# EAGLE board BansheeNornV5 (EAGLE 9.6.2), part 1 of 2
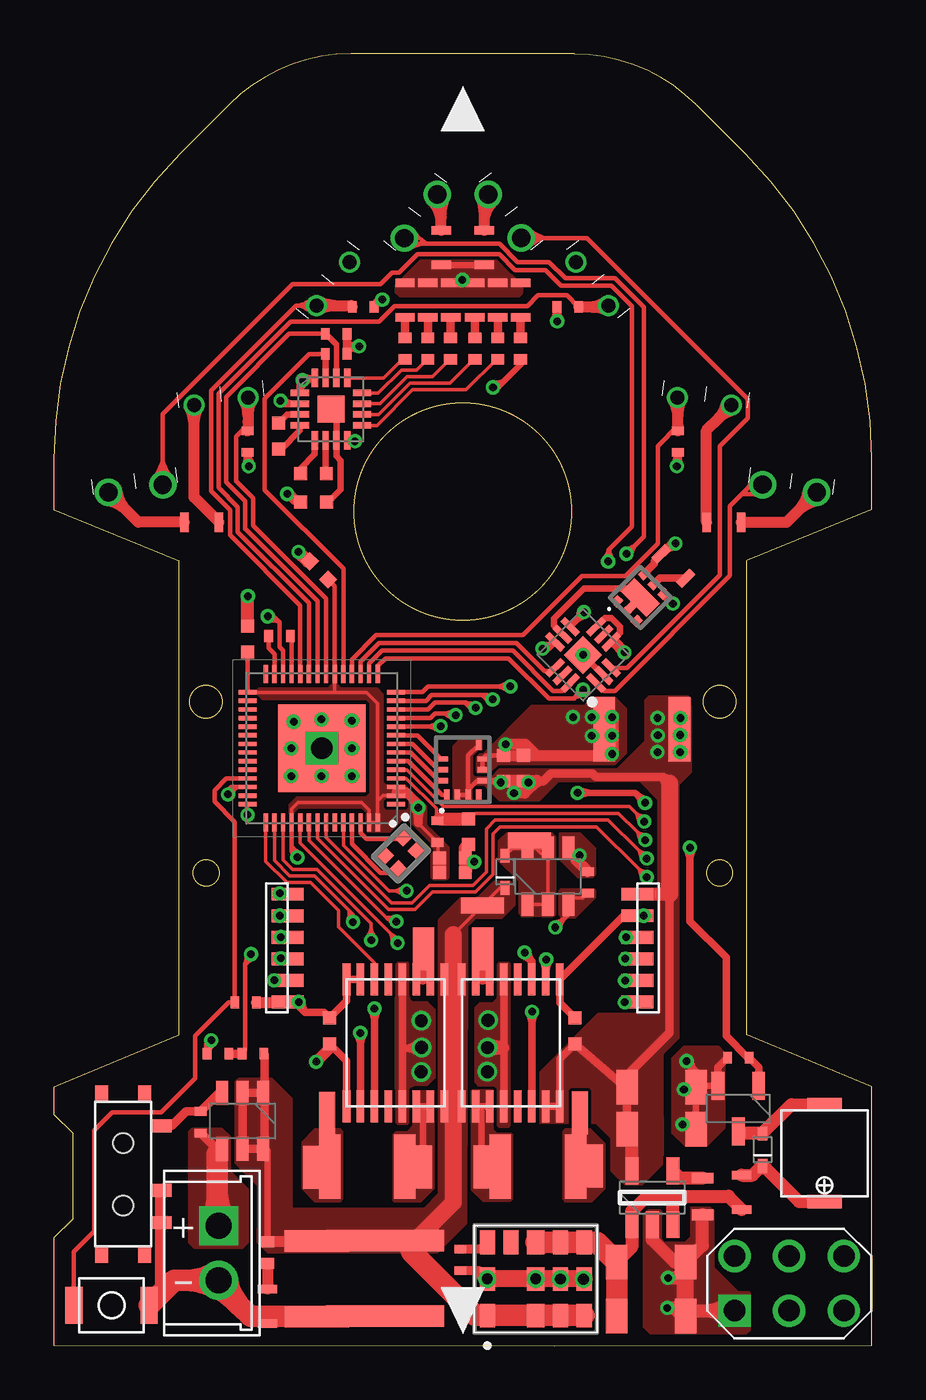
[diagram p2: board, top side]
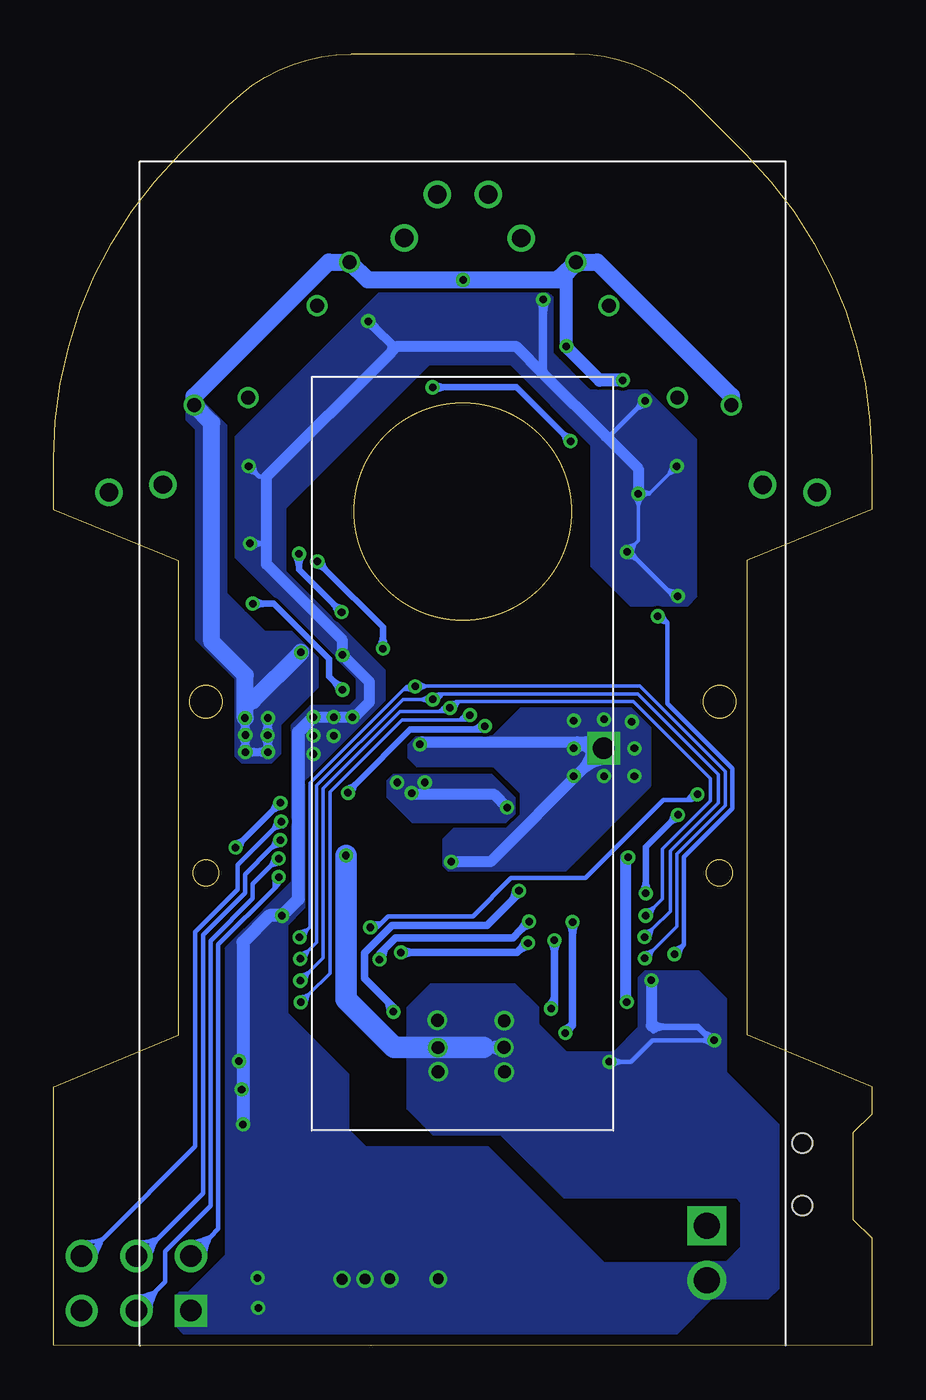
[diagram p3: board, bottom side, seen from below]

Size 38 x 60.01 mm. Coordinates in mm from the lower left corner, seen from the top.
Outline: 32.13,55.36 29.84,57.65 arc45 24.18,59.99
Outline: 32.13,55.36 arc-45 38,41.21 38,38.85 32.21,36.46 32.21,14.44 38,12.03 38,0.01 23.25,0 0,0.01 0,5 0.88,5.88 0.88,9.88 0,10.75 0,12.03 5.79,14.44 5.79,36.46 0,38.85 0,41.21
Outline: 8.15,57.65 5.87,55.36 arc45 0,41.21
Outline: 24.18,60.01 13.82,60.01 arc45 8.15,57.65
Outline: circle at 7.08,21.96 radius 0.6
Outline: circle at 7.08,29.92 radius 0.76
Outline: circle at 30.93,21.96 radius 0.6
Outline: circle at 30.93,29.92 radius 0.76
Outline: circle at 19,38.75 radius 5.05
Copper layers (1*16): Top 0.035mm / dielectric 1.6mm / Bottom 0.035mm
Design rules "Elecrow_2-layer_PCB_eagle_rule *": minimum track width 6mil, minimum drill 12mil, track to track 6mil, track to pad 6mil, pad to pad 6mil, via to via 8mil, smd to smd 0mil, copper to edge 20mil, drill to drill 10mil, minimum pad ring 6mil, minimum via ring 6mil, stop-mask expansion 0mil, vias tented up to drill 100mil, thermal gap 0mil

## Footprints (pad centres in the part's own frame; a part is rotated, then mirrored left to right if it is on the bottom)
C3216 = smd 1 x 1.6: 1 -1.6,0; 2 1.6,0
R1005 = smd 0.6 x 0.6: P$1 -0.6,0; P$2 0.6,0
C1608 = smd 0.5 x 1: 1 -0.85,0; 2 0.85,0
HRCON-2 = drill 1.2 pad 1.778 square: 1 0,0 | drill 1.2 pad 1.778: 2 0,-2.54
SODFL1608X70N = smd 0.64 x 0.42: 1 -0.75,0; 2 0.75,0
QFN40P700X700X90-57N = smd 0.85 x 0.2: 1 -3.45,2.6; 2 -3.45,2.2; 3 -3.45,1.8; 4 -3.45,1.4; 5 -3.45,1; 6 -3.45,0.6; 7 -3.45,0.2; 8 -3.45,-0.2; 9 -3.45,-0.6; 10 -3.45,-1; 11 -3.45,-1.4; 12 -3.45,-1.8; 13 -3.45,-2.2; 14 -3.45,-2.6; 29 3.45,-2.6; 30 3.45,-2.2; 31 3.45,-1.8; 32 3.45,-1.4; 33 3.45,-1; 34 3.45,-0.6; 35 3.45,-0.2; 36 3.45,0.2; 37 3.45,0.6; 38 3.45,1; 39 3.45,1.4; 40 3.45,1.8; 41 3.45,2.2; 42 3.45,2.6 | smd 0.2 x 0.85: 15 -2.6,-3.45; 16 -2.2,-3.45; 17 -1.8,-3.45; 18 -1.4,-3.45; 19 -1,-3.45; 20 -0.6,-3.45; 21 -0.2,-3.45; 22 0.2,-3.45; 23 0.6,-3.45; 24 1,-3.45; 25 1.4,-3.45; 26 1.8,-3.45; 27 2.2,-3.45; 28 2.6,-3.45; 43 2.6,3.45; 44 2.2,3.45; 45 1.8,3.45; 46 1.4,3.45; 47 1,3.45; 48 0.6,3.45; 49 0.2,3.45; 50 -0.2,3.45; 51 -0.6,3.45; 52 -1,3.45; 53 -1.4,3.45; 54 -1.8,3.45; 55 -2.2,3.45; 56 -2.6,3.45 | smd 4.05 x 4.05: 57 0,0
QFN50P300X300X80-17N = smd 0.85 x 0.3: 1 -1.45,0.75; 2 -1.45,0.25; 3 -1.45,-0.25; 4 -1.45,-0.75; 9 1.45,-0.75; 10 1.45,-0.25; 11 1.45,0.25; 12 1.45,0.75 | smd 0.3 x 0.85: 5 -0.75,-1.45; 6 -0.25,-1.45; 7 0.25,-1.45; 8 0.75,-1.45; 13 0.75,1.45; 14 0.25,1.45; 15 -0.25,1.45; 16 -0.75,1.45 | smd 1.25 x 1.25: 17 0,0
LGA-14(2.5X3X0.86) = smd 0.475 x 0.25: 1 -1.163,0.75; 2 -1.163,0.25; 3 -1.163,-0.25; 4 -1.163,-0.75; 8 1.163,-0.75 | smd 0.25 x 0.475: 5 -0.5,-0.912; 6 0,-0.912; 7 0.5,-0.912; 12 0.5,0.912; 13 0,0.912; 14 -0.5,0.912
SOT95P275X110-5N = smd 1.25 x 0.6: 1 -1.25,0.95; 2 -1.25,0; 3 -1.25,-0.95; 4 1.25,-0.95; 5 1.25,0.95
QFN50P300X300X100-13N = smd 1 x 0.3: 1 -1.35,0.5; 2 -1.35,0; 3 -1.35,-0.5; 7 1.35,-0.5; 8 1.35,0; 9 1.35,0.5 | smd 0.3 x 1: 4 -0.5,-1.35; 5 0,-1.35; 6 0.5,-1.35; 10 0.5,1.35; 11 0,1.35; 12 -0.5,1.35 | smd 1.25 x 1.25: 13 0,0
BCR421UFD7 = smd 0.37 x 0.45: 1 -0.65,-0.886; 3 0.65,-0.886; 4 0.65,0.886; 5 0,0.886; 6 -0.65,0.886 | smd 0.37 x 0.6: 2 0,-0.75 | smd 1.67 x 0.9: 7 0,0
LTR4206E = drill 0.65 pad 0.9: 1 -1.27,0; 2 1.27,0
SOT95P284X110-6N = smd 1.1 x 0.55: 1 -1.3,0.95; 2 -1.3,0; 3 -1.3,-0.95; 4 1.3,-0.95; 5 1.3,0; 6 1.3,0.95
SOT95P237X112-3N = smd 1.3 x 0.6: 1 -1.05,0.95; 2 -1.05,-0.95; 3 1.05,0
R1005' = smd 0.4 x 0.55: P$1 -0.502,0; P$2 0.501,0
R1608 = smd 0.4 x 0.9: 1 -0.8,0; 2 0.8,0
LXDC55FAAA203 = smd 0.7 x 1.1: 1 0,0; 4 -3.4,0; 5 -4.5,0; 6 -4.5,-1.7; 7 -4.5,-3.4; 8 -3.4,-3.4; 10 -1.1,-3.4; 11 0,-3.4; 12 0,-1.7; 14 -3.4,-1.7 | smd 0.8 x 1.1: 3 -2.25,0; 9 -2.25,-3.4; 13 -2.25,-1.7
PAD = smd 0.75 x 2: P$1 0,0
LED_1005 = smd 0.5 x 0.6: P$1 -0.5,0; P$2 0.5,0
PANA = smd 1 x 3: P$1 -1.75,0; P$2 1.75,0
SFH_4550 = drill 0.85: ANODE -1.27,0; CASODE 1.27,0
PIN2_3 = drill 1 square: P$1 0,0 | drill 1: P$2 2.54,0; P$3 5.08,0; P$4 0,2.54; P$5 2.54,2.54; P$6 5.08,2.54
BUZZER = smd 0.635 x 1.6: + 4.25,2; - -0.25,2
ENCORDER_R = smd 0.6 x 1.5: P$1 -2.5,-1; P$2 -1.5,-1; P$3 -0.5,-1; P$4 0.5,-1; P$5 1.5,-1; P$6 2.5,-1
TB6614 = smd 0.35 x 1.5: P$1 -2.275,-2.95; P$2 -1.625,-2.95; P$3 -0.975,-2.95; P$4 -0.325,-2.95; P$5 0.325,-2.95; P$6 0.975,-2.95; P$7 1.625,-2.95; P$8 2.275,-2.95; P$9 2.275,2.95; P$10 1.625,2.95; P$11 0.975,2.95; P$12 0.325,2.95; P$13 -0.325,2.95; P$14 -0.975,2.95; P$15 -1.625,2.95; P$16 -2.275,2.95
TVAF06 = smd 1.7 x 0.8: P$1 1.45,3.25; P$2 1.45,-0.25
SWITCH = smd 0.75 x 0.6: P$1 -0.4,0.3; P$2 -0.4,2.3; P$3 7.1,0.3; P$4 7.1,2.3 | smd 0.6 x 1: P$5 5.6,3.05; P$6 4.1,3.05; P$7 1.1,3.05 | hole 0.9: 1.9,1.3; 4.8,1.3
XRCGB32_F = smd 0.75 x 0.7: 1 -0.675,-0.5; 2 0.675,-0.5; 3 0.675,0.5; 4 -0.675,0.5

## Placement (x,y rotation side)
C1  [C3216]  27.75,3.88 180 top
C2  0.1u  [R1005]  20.88,26.82 90 top
C3  0.1u  [R1005]  18.52,22.66 0 top
C4  [C3216]  28.23,12 180 top
C5  0.1u  [R1005]  19.27,23.88 90 top
C6  [C3216]  27.75,1.38 180 top
C7  1u  [R1005]  10.43,42.26 270 top
C8  0.1u  [R1005]  18.52,21.97 0 top
C9  [C1608]  30.14,6.93 90 top
C11  1u  [R1005]  12.06,40.5 0 top
C12  100nF  [R1005]  21.82,26.82 90 top
C13  0.1u  [R1005]  12.81,14.62 90 top
C14  [C3216]  28.23,10.06 180 top
C16  1u  [R1005]  12.06,39.19 180 top
C17  0.1u  [R1005]  12.31,36.01 315 top
C18  0.1u  [R1005]  24.21,14.62 270 top
C21  100nF  [R1005]  9,32.83 90 top
CN2  [HRCON-2]  7.66,5.57 0 top
D1  RB520S30T5G  [SODFL1608X70N]  32.93,9.11 90 top
D2  RB520S30T5G  [SODFL1608X70N]  20.97,22.01 90 top
IC1  ESP32-S3-WROOM-1-N8  [QFN40P700X700X90-57N]  12.45,27.75 180 top
IC2  MAX8647ETE+  [QFN50P300X300X80-17N]  12.88,43.5 0 top
IC3  LSM6DS3USTR  [LGA-14(2.5X3X0.86)]  19,26.75 90 top
IC4  NCV8163ASN330T1G  [SOT95P275X110-5N]  27.8,6.88 90 top
IC6  DG2034EDN-T1-GE4  [QFN50P300X300X100-13N]  24.59,32.09 135 top
IC7  BCR421UFD-7  [BCR421UFD7]  27.25,34.75 315 top
Q1  LTR-4206E  [LTR4206E]  7.77,43.86 188 top
Q2  SI3493DDV-T1-GE3  [SOT95P284X110-6N]  8.78,10.44 270 top
Q3  IRFML8244TRPBF  [SOT95P237X112-3N]  31.79,11.02 270 top
Q4  LTR-4206E  [LTR4206E]  12.98,49.33 127 bottom
Q5  SI3460DDV-T1-GE3  [SOT95P284X110-6N]  22.95,21.8 90 top
Q7  LTR-4206E  [LTR4206E]  30.22,43.86 352 top
Q8  LTR-4206E  [LTR4206E]  25.01,49.32 127 top
R1  10k  [R1005']  17.82,23.88 90 top
R2  3k  [R1005']  9.25,13.56 180 top
R3  1k  [R1005']  7.62,13.56 180 top
R4  10k  [R1005']  10.48,32.96 0 top
R5  0.5k  [R1005']  18.88,3.99 270 top
R6  18  [R1608]  9.92,1.84 90 top
R7  10k  [R1005']  6.82,10.38 270 top
R8  10k  [R1005']  8.91,15.94 0 top
R9  10k  [R1005']  31.8,13.38 180 top
R10  18  [R1608]  31.96,7.12 90 top
R12  10k  [R1005']  13.12,46.07 180 top
R13  10k  [R1005']  13.12,47 0 top
R15  18  [R1608]  20,51 90 top
R16  1k  [R1005']  23.88,48.25 0 top
R17  1k  [R1005']  14.38,48.25 180 top
R18  1k  [R1005']  9,42 90 top
R19  18  [R1608]  28.79,36.21 315 top
R21  10k  [R1005']  24.81,21.52 90 top
R22  1k  [R1005']  29,42 90 top
R25  18  [R1608]  6.88,38.25 180 top
R26  18  [R1608]  31.12,38.25 0 top
R27  18  [R1608]  21.68,48.56 90 top
R28  18  [R1608]  20.62,48.56 90 top
R29  18  [R1608]  18,51 90 top
R30  18  [R1608]  19.56,48.56 90 top
R31  18  [R1608]  18.44,48.56 90 top
R32  18  [R1608]  17.38,48.56 90 top
R33  18  [R1608]  16.32,48.56 90 top
U1  LXDC55FAAA-203  [LXDC55FAAA203]  20.14,1.4 180 top
U$1  PAD  [PAD]  17.29,18.43 180 top
U$2  LED_1005  [LED_1005]  9.94,4.32 270 top
U$3  PANA  [PANA]  14.56,8.31 180 top
U$4  SFH4550  [SFH_4550]  34.19,39.82 172 top
U$5  PANA  [PANA]  14.14,3.12 90 top
U$6  PIN2_3  [PIN2_3]  31.62,1.62 0 top
U$7  PANA  [PANA]  22.5,8.31 0 top
U$8  PAD  [PAD]  20.06,18.43 180 top
U$9  PAD  [PAD]  17.19,8.31 0 top
U$10  SFH4550  [SFH_4550]  20.95,52.46 307 top
U$11  PAD  [PAD]  11.95,8.29 0 top
U$12  PANA  [PANA]  16.62,3.12 90 top
U$13  BUZZER_44  [BUZZER]  33.81,10.94 270 top
U$14  SFH4550  [SFH_4550]  17.05,52.46 307 bottom
U$15  ENCORDER_1  [ENCORDER_R]  9.86,18.47 90 top
U$16  PANA  [PANA]  12.22,3.11 90 top
U$17  PAD  [PAD]  19.88,8.31 0 top
U$18  TB6614  [TB6614]  15.88,14.07 0 top
U$19  LED_1005  [LED_1005]  19.56,46.31 270 top
U$20  PAD  [PAD]  19.92,20.46 90 top
U$21  LED_1005  [LED_1005]  18.44,46.31 270 top
U$22  TB6614  [TB6614]  21.23,14.07 180 top
U$23  LED_1005  [LED_1005]  17.38,46.31 270 top
U$24  PANA  [PANA]  27.31,28.62 0 top
U$25  LED_1005  [LED_1005]  20.62,46.31 270 top
U$26  PAD  [PAD]  24.44,10.82 0 top
U$27  PAD  [PAD]  12.69,10.8 0 top
U$28  ENCORDER_1  [ENCORDER_R]  28.12,18.47 270 top
U$29  PAD  [PAD]  19.81,18.44 0 top
U$30  LED_1005  [LED_1005]  16.31,46.31 270 top
U$31  LED_1005  [LED_1005]  21.69,46.31 270 top
U$32  PAD  [PAD]  17.06,18.44 0 top
U$43  TVAF06  [TVAF06]  4.18,0.43 90 top
U$44  SFH4550  [SFH_4550]  3.8,39.81 8 top
U$53  SWICH  [SWITCH]  1.92,11.32 270 top
U$57  PAD  [PAD]  25.13,8.35 0 top
U$58  PAD  [PAD]  22.09,23.46 270 top
Y1  XRCGB40M000F5A00R0  [XRCGB32_F]  16.13,22.87 225 top